# EAGLE design ESP_flagServer (EAGLE 9.6.2)
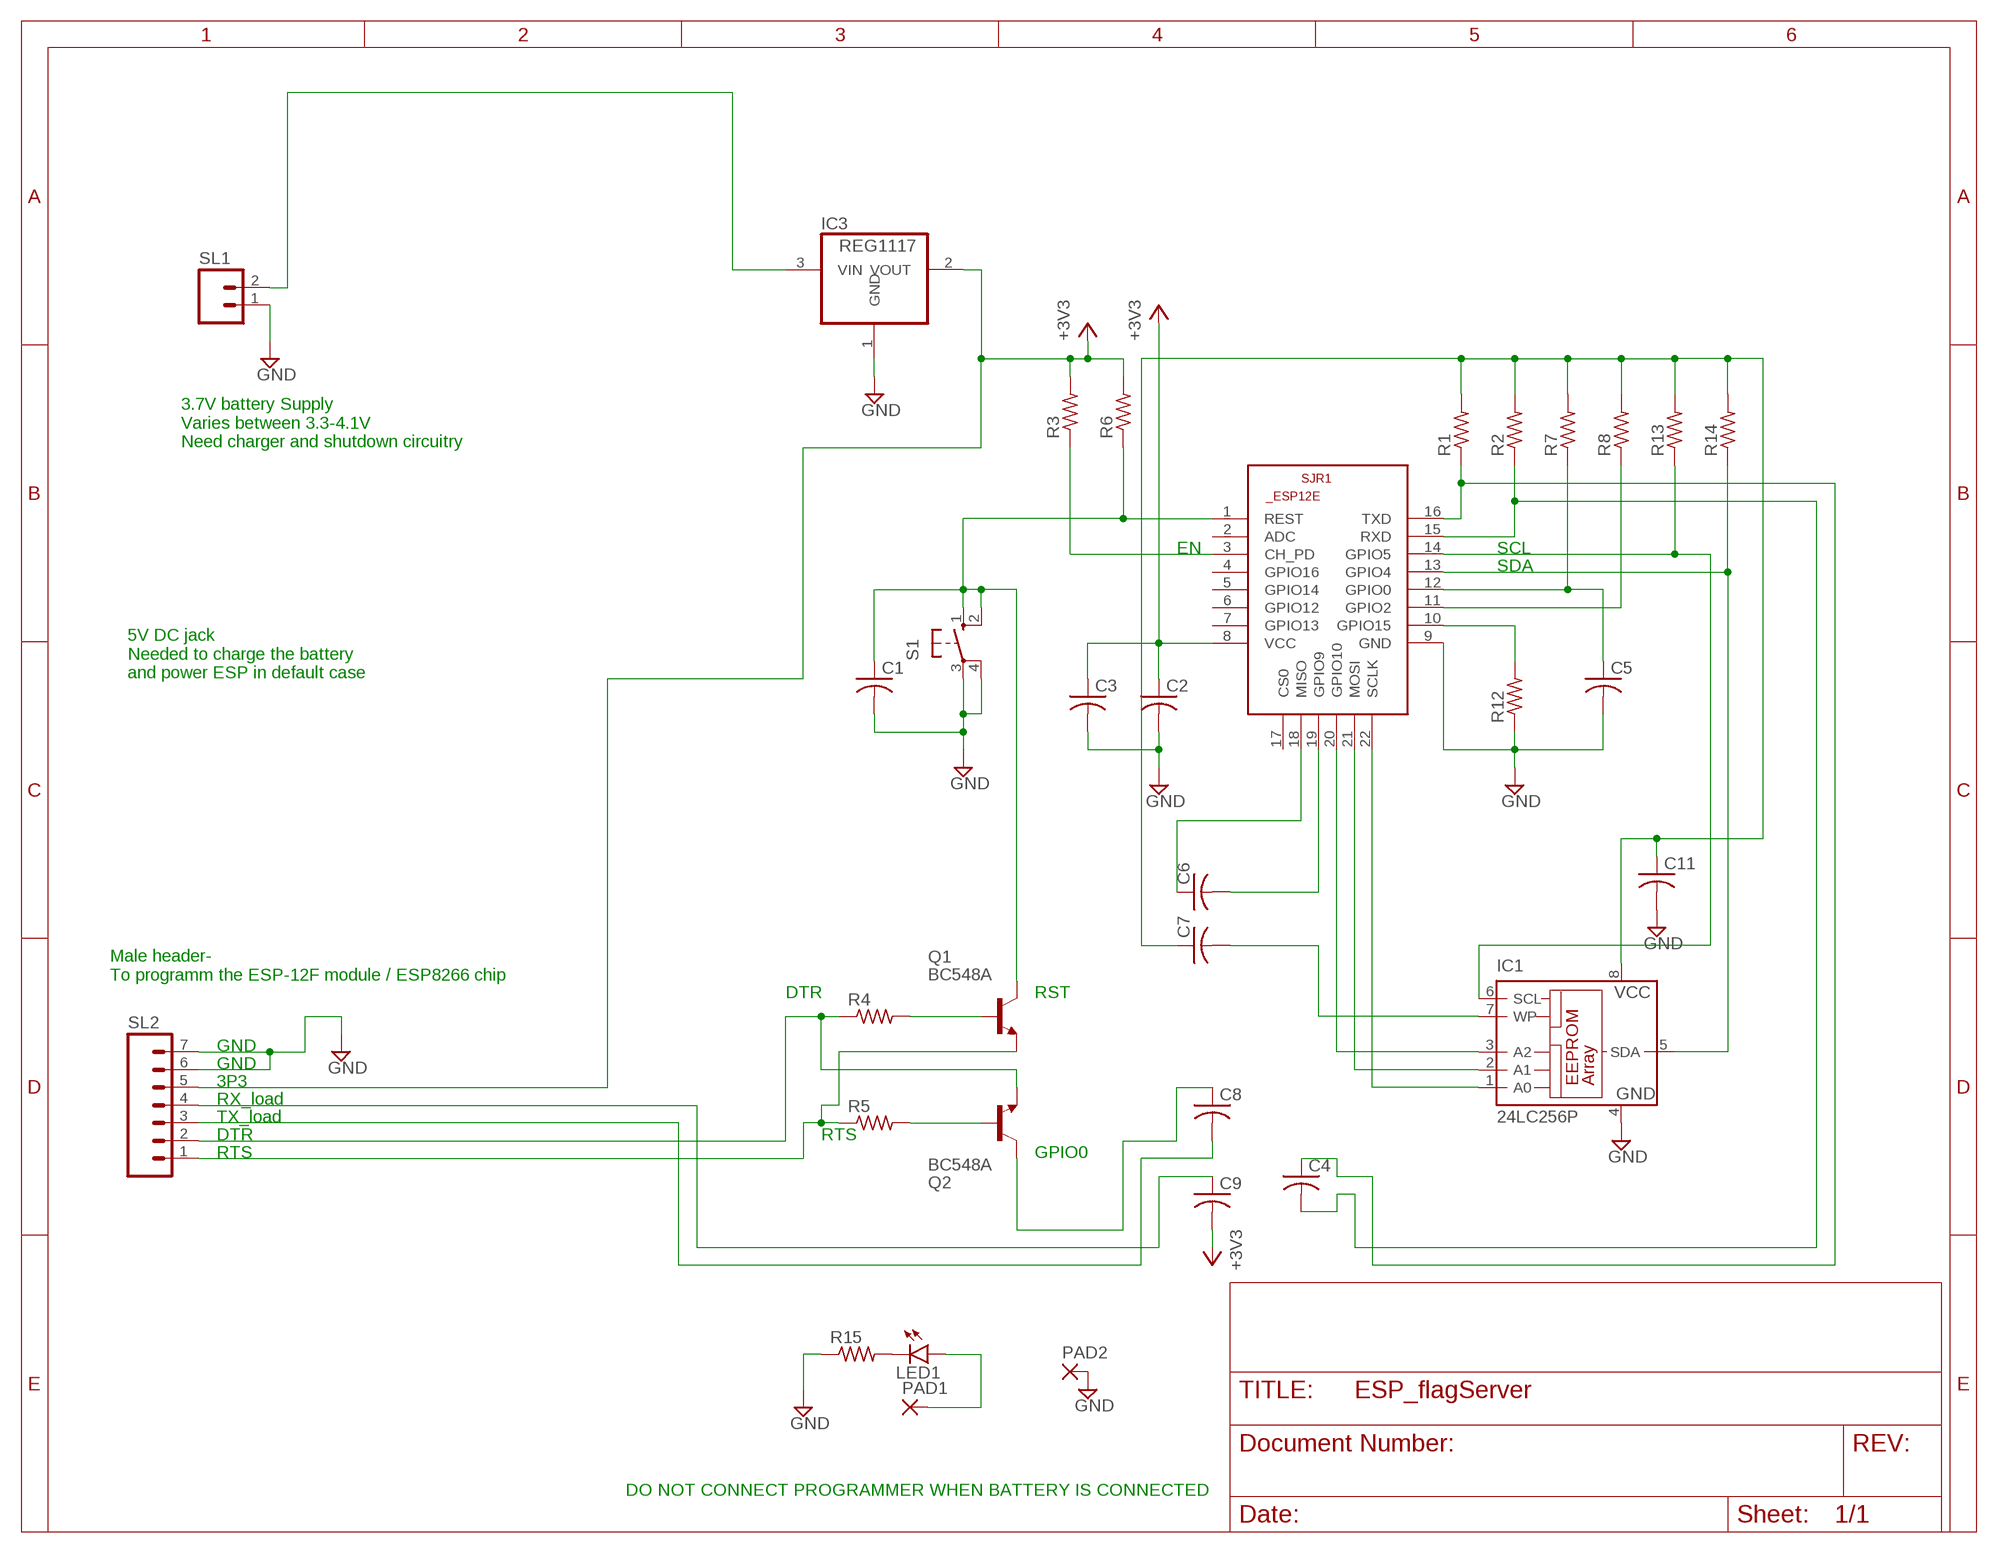
[diagram p0: schematic, sheet 1]

## Parts
C1  C-US050-024X044  [C050-024X044]
C2  C-US050-024X044  [C050-024X044]
C3  C-US050-024X044  [C050-024X044]
C4  C-US025-024X044  [C025-024X044]
C5  C-US025-024X044  [C025-024X044]
C6  C-US025-024X044  [C025-024X044]
C7  C-US025-024X044  [C025-024X044]
C8  C-US025-024X044  [C025-024X044]
C9  C-US025-024X044  [C025-024X044]
C11  C-US025-024X044  [C025-024X044]
IC1  24LC256P  [DIL8]
IC3  REG1117  [SOT223]
LED1  LED3MM  [LED3MM]
PAD1  2,15/1,0  [2,15/1,0]
PAD2  2,15/1,0  [2,15/1,0]
Q1  BC548A  [TO92-EBC]
Q2  BC548A  [TO92-EBC]
R1  R-US_0204/7  [0204/7]
R2  R-US_0204/7  [0204/7]
R3  R-US_0204/7  [0204/7]
R4  R-US_0204/7  [0204/7]
R5  R-US_0204/7  [0204/7]
R6  R-US_0204/7  [0204/7]
R7  R-US_0204/7  [0204/7]
R8  R-US_0204/7  [0204/7]
R12  R-US_0204/7  [0204/7]
R13  R-US_0204/7  [0204/7]
R14  R-US_0204/7  [0204/7]
R15  R-US_0204/7  [0204/7]
S1  10-XX  [B3F-10XX]
SJR1  ESP8266-12EESP12E  [ESP8266-ESP12E]
SL1  M02  [02P]
SL2  M07  [07P]

## Nets
+3V3: C2.1 C3.1 C9.2 IC3.2(VOUT) R3.2 R6.2 SJR1.8(VCC) SL2.5
GND: C1.2 C2.2 C3.2 C5.2 C11.2 IC1.4(GND) IC3.1(GND) PAD2.1(P) R12.1 R15.1 S1.3(P) S1.4(P1) SJR1.9(GND) SL1.1 SL2.6 SL2.7
N$1: C4.1 R1.1 SJR1.16(TXD)
N$2: Q2.B R5.2
N$3: IC1.6(SCL) R13.1 SJR1.14(GPIO5)
N$4: IC1.5(SDA) R14.1 SJR1.13(GPIO4)
N$5: C8.1 Q2.C
N$6: R8.1 SJR1.11(GPIO2)
N$7: R12.2 SJR1.10(GPIO15)
N$8: LED1.A PAD1.1(P)
N$9: R3.1 SJR1.3(CH_PD)
N$10: IC3.3(VIN) SL1.2
N$11: IC1.1(A0) SJR1.22(SCLK)
N$12: C1.1 Q1.C R6.1 S1.1(S) S1.2(S1) SJR1.1(REST)
N$14: C8.2 SL2.3
N$15: Q1.B R4.2
N$16: Q2.E R4.1 SL2.2
N$17: Q1.E R5.1 SL2.1
N$21: IC1.2(A1) SJR1.21(MOSI)
N$22: IC1.3(A2) SJR1.20(GPIO10)
N$23: C7.2 IC1.7(WP)
N$25: LED1.K(C) R15.2
N$27: C4.2 R2.1 SJR1.15(RXD)
N$28: C6.1 SJR1.18(MISO)
N$29: C9.1 SL2.4
N$30: C5.1 R7.1 SJR1.12(GPIO0)
N$32: C6.2 SJR1.19(GPIO9)
N$34: C7.1 C11.1 IC1.8(VCC) R1.2 R2.2 R7.2 R8.2 R13.2 R14.2
Unconnected: SJR1.2(ADC) SJR1.4(GPIO16) SJR1.5(GPIO14) SJR1.6(GPIO12) SJR1.7(GPIO13) SJR1.17(CS0)

## Notes on the sheet
- 3.7V battery Supply
  Varies between 3.3-4.1V
  Need charger and shutdown circuitry
- EN | SCL
- SDA
- 5V DC jack
  Needed to charge the battery 
  and power ESP in default case
- Male header-
  To programm the ESP-12F module / ESP8266 chip
- DTR | RST
- GND
- GND
- 3P3
- RX_load
- TX_load
- DTR | RTS
- RTS | GPIO0
- DO NOT CONNECT PROGRAMMER WHEN BATTERY IS CONNECTED

## Library data of the parts
C1-C9 C11 = rcl:C-US: CAPACITOR, American symbol; SPICEPREFIX: C
IC1 = microchip:24*: Serial EEPROM I2C; MF: MICROCHIP; MPN: 24LC256-E/P; OC_FARNELL: 9757970; OC_NEWARK: 92C7169
IC3 = burr-brown:REG1117: 800mA and 1A Low Dropout (LDO) Positive Regulator 1.8V, 2.5V, 2.85V, 3.3V, 5V, and Adj; MPN: REG1117; OC_FARNELL: 1097566; OC_NEWARK: 14P6981
LED1 = led:LED: LED OSRAM: - CHIPLED LG R971, LG N971, LY N971, LG Q971, LY Q971, LO R971, LY R971 LH N974, LH R974 LS Q976, LO Q976, LY Q976 LO Q996 - Hyper CHIPLED LW Q18S LB Q993, LB Q99A, LB R99A - SideLED LS A670, LO A670, LY A670, LG A670, LP A670 LB A673, LV A673, LT A673, LW A673 LH A674 LY A675 LS A676, LA A676, LO A676, LY A676, LW A676 LS A679, LY A679, LG A679 - Hyper Micro SIDELED® LS Y876, LA Y876, LO Y876, LY Y876 LT Y87S - SmartLED LW L88C, LW L88S LB L89C, LB L89S, LG L890 LS L89K, LO L89K, LY L89K LS L896, LA L896, LO L896, LY L896 - TOPLED LS T670, LO T670, LY T670, LG T670, LP T670 LSG T670, LSP T670, LSY T670, LOP T670, LYG T670 LG T671, LOG T671, LSG T671 LB T673, LV T673, LT T673, LW T673 LH T674 LS T676, LA T676, LO T676, LY T676, LB T676, LH T676, LSB T676, LW T676 LB T67C, LV T67C, LT T67C, LS T67K, LO T67K, LY T67K, LW E67C LS E67B, LA E67B, LO E67B, LY E67B, LB E67C, LV E67C, LT E67C LW T67C LS T679, LY T679, LG T679 LS T770, LO T770, LY T770, LG T770, LP T770 LB T773, LV T773, LT T773, LW T773 LH T774 LS E675, LA E675, LY E675, LS T675 LS T776, LA T776, LO T776, LY T776, LB T776 LHGB T686 LT T68C, LB T68C - Hyper Mini TOPLED® LB M676 - Mini TOPLED Santana® LG M470 LS M47K, LO M47K, LY M47K Source: http://www.osram.convergy.de LUXEON: - LUMILED® LXK2-PW12-R00, LXK2-PW12-S00, LXK2-PW14-U00, LXK2-PW14-V00 LXK2-PM12-R00, LXK2-PM12-S00, LXK2-PM14-U00 LXK2-PE12-Q00, LXK2-PE12-R00, LXK2-PE12-S00, LXK2-PE14-T00, LXK2-PE14-U00 LXK2-PB12-K00, LXK2-PB12-L00, LXK2-PB12-M00, LXK2-PB14-N00, LXK2-PB14-P00, LXK2-PB14-Q00 LXK2-PR12-L00, LXK2-PR12-M00, LXK2-PR14-Q00, LXK2-PR14-R00 LXK2-PD12-Q00, LXK2-PD12-R00, LXK2-PD12-S00 LXK2-PH12-R00, LXK2-PH12-S00 LXK2-PL12-P00, LXK2-PL12-Q00, LXK2-PL12-R00 Source: www.luxeon.com KINGBRIGHT: KA-3528ASYC Source: www.kingbright.com
PAD1 PAD2 = wirepad:2,15/1,0: THROUGH-HOLE PAD
Q1 Q2 = transistor-npn:BC548*: NPN Transistor
R1-R8 R12-R15 = rcl:R-US_: RESISTOR, American symbol; SPICEPREFIX: R
S1 = switch-omron:10-XX: OMRON SWITCH; MPN: B3F-1000; OC_FARNELL: 176432; OC_NEWARK: 36M3542
SJR1 = esp12e:ESP8266-12E: ESP8266-12E Library for Eagle CAD The author not responsible for any damages or errors!. Created by Suhail jr.lt;/author>
SL1 = con-amp-quick:M02: AMP QUICK CONNECTOR; OC_FARNELL: unknown; OC_NEWARK: unknown
SL2 = con-amp-quick:M07: AMP QUICK CONNECTOR; OC_FARNELL: unknown; OC_NEWARK: unknown

## Board
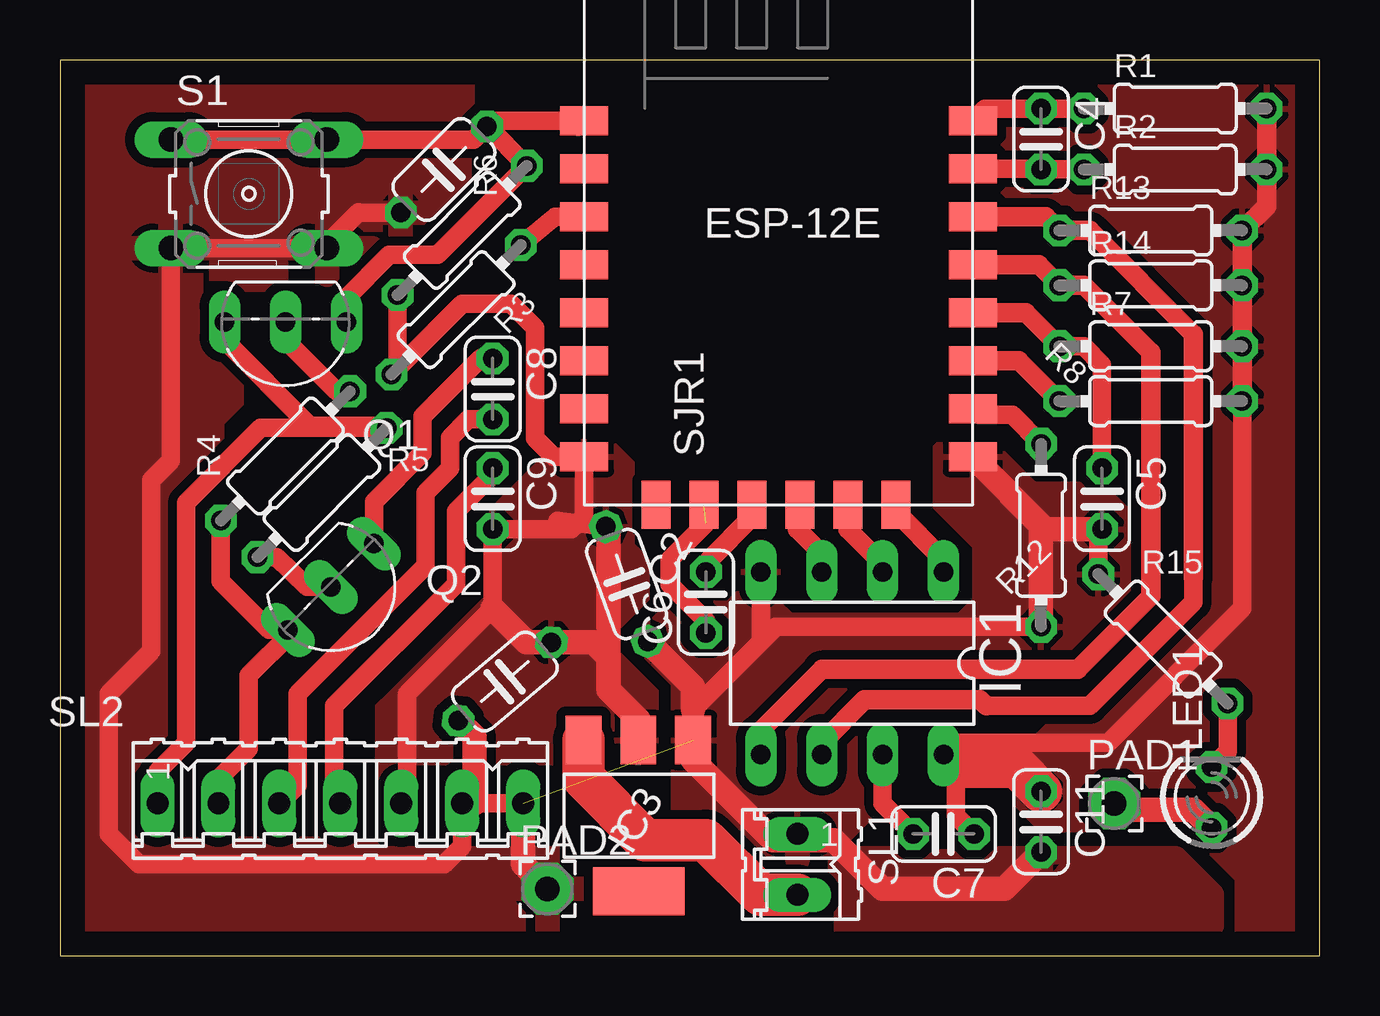
[diagram p1: board, top side]

Size 52.5 x 37.33 mm. Coordinates in mm from the lower left corner, seen from the top.
Outline: 0,0 52.5,0 52.5,37.33 0,37.33 0,0
Copper layers (1*16): Top 0.035mm / dielectric 1.5mm / Bottom 0.035mm
Design rules "default *": minimum track width 6mil, minimum drill 0.35mm, track to track 15mil, track to pad 15mil, pad to pad 15mil, via to via 15mil, smd to smd 6mil, copper to edge 40mil, drill to drill 6mil, minimum pad ring 10mil, minimum via ring 8mil, stop-mask expansion 4mil, vias tented up to drill 0mil, thermal gap 10mil

### Footprints (pad centres in the part's own frame; a part is rotated, then mirrored left to right if it is on the bottom)
C050-024X044 = drill 0.813 octagon: 1 -2.54,0; 2 2.54,0
C025-024X044 = drill 0.813 octagon: 1 -1.27,0; 2 1.27,0
DIL8 = drill 0.813 long: 1 -3.81,-3.81; 2 -1.27,-3.81; 3 1.27,-3.81; 4 3.81,-3.81; 5 3.81,3.81; 6 1.27,3.81; 7 -1.27,3.81; 8 -3.81,3.81
SOT223 = smd 1.499 x 2.007: 1 -2.261,-3.15; 2 0.025,-3.15; 3 2.311,-3.15 | smd 3.81 x 2.007: 4 0,3.15
LED3MM = drill 0.813 octagon: A -1.27,0; K 1.27,0
2,15/1,0 = drill 1.016 pad 2.159 octagon: 1 0,0
TO92-EBC = drill 0.813 long: B 0,-1.27; C -2.54,-1.27; E 2.54,-1.27
0204/7 = drill 0.813 octagon: 1 -3.81,0; 2 3.81,0
B3F-10XX = drill 1.016 long: 1 -3.251,2.261; 2 3.251,2.261; 3 -3.251,-2.261; 4 3.251,-2.261
ESP8266-ESP12E = smd 2 x 1.2: 1 -7.62,5.84; 2 -7.62,3.84; 3 -7.62,1.84; 4 -7.62,-0.16; 5 -7.62,-2.16; 6 -7.62,-4.16; 7 -7.62,-6.16; 8 -7.62,-8.16; 9 8.58,-8.16; 10 8.58,-6.16; 11 8.58,-4.16; 12 8.58,-2.16; 13 8.58,-0.16; 14 8.58,1.84; 15 8.58,3.84; 16 8.58,5.84 | smd 1.2 x 2: 17 -4.62,-10.16; 18 -2.62,-10.16; 19 -0.62,-10.16; 20 1.38,-10.16; 21 3.38,-10.16; 22 5.38,-10.16
02P = drill 0.914 long: 1 -1.27,0; 2 1.27,0
07P = drill 0.914 long: 1 -7.62,0; 2 -5.08,0; 3 -2.54,0; 4 0,0; 5 2.54,0; 6 5.08,0; 7 7.62,0

### Placement (x,y rotation side)
C1  16,32.77 225 top
C2  23.62,15.49 290 top
C3  18.54,11.43 220 top
C4  40.89,34.04 270 top
C5  43.43,19.05 270 top
C6  26.92,14.73 90 top
C7  36.83,5.08 180 top
C8  18.03,23.62 270 top
C9  18.03,19.05 270 top
C11  40.89,5.59 270 top
IC1  33.02,12.19 180 top
IC3  24.13,5.84 180 top
LED1  48.01,6.6 90 top
PAD1  43.94,6.35 0 top
PAD2  20.32,2.79 0 top
Q1  9.4,25.15 180 top
Q2  12.19,14.48 225 top
R1  46.48,35.31 0 top
R2  46.48,32.77 0 top
R3  16.51,26.92 225 top
R4  9.4,20.83 45 top
R5  10.92,19.3 225 top
R6  16.76,30.23 225 top
R7  45.47,25.4 0 top
R8  45.47,23.11 0 top
R12  40.89,17.53 90 top
R13  45.47,30.23 0 top
R14  45.47,27.94 0 top
R15  45.97,13.21 315 top
S1  7.87,31.75 0 top
SJR1  29.46,28.96 0 top
SL1  30.73,3.81 270 top
SL2  11.68,6.35 0 top

### Tracks (layer width: path | path; a pad name or v marks a point on that pad's centre or on a via)
+3V3
  Top 0.762: C9.2 21.32,17.78 21.84,18.31 SJR1.8 20.57,20.8 19.81,21.56 19.81,26.16 18.8,27.18 16.76,27.18 14.07,24.48 | R6.2 14.07,24.48 | 14.07,24.48 R3.2 | SL2.5 14.48,6.6 14.48,10.92 18.03,14.48 C9.2 | 20.75,18.13 C2.1 | C9.2 18.53,17.78
  Top 1.016: IC3.2 24.11,9.85 22.86,11.09 22.86,12.45 | C2.1 22.86,17.77 22.86,12.45 | 22.86,12.45 22.24,13.06 C3.1 19.45,13.06 18.03,14.48
  pour Top: 13.21,6.99 13.21,10.41 13.72,10.92 17.91,15.11 17.91,18.54 18.03,18.67 20.83,21.46 21.21,21.46 22.99,21.46 23.88,20.57 23.88,17.14 24.51,16.51 24.51,14.86 24.38,14.73 23.11,13.46 23.11,12.83 24.89,11.05 24.89,8 14.48,8 13.46,6.99
GND  (1 unrouted)
  Top 0.762: C1.2 12.46,30.97 12.45,30.99 11.12,29.67 S1.4 S1.3 4.62,20.62 3.81,19.81 3.81,12.7 2.03,10.92 2.03,5.08 3.3,3.81 16,3.81 16.76,4.57 SL2.6 17.27,6.35 SL2.7 19.3,5.84 | IC1.4 29.21,13.08 | 29.21,13.08 29.84,13.72 R12.1 | 29.21,13.08 26.39,10.26 IC3.1 | R15.1 43.28,17.63 C5.2
  Top 1.016: SJR1.9 41.06,17.78 | C5.2 40.89,17.78 R12.1 | C11.2 39.37,2.79 34.29,2.79 32.26,4.83 30.99,4.83 | 30.99,4.83 SL1.1 | IC3.1 26.39,8.15 29.72,4.83 30.99,4.83 | C2.2 26.39,11.21 26.39,10.26 | C3.2 17.27,9.12 17.27,6.35 | SL2.7 19.3,3.81 PAD2.1
  pour Top: 20.57,36.83 20.57,36.58 19.3,35.31 6.35,22.35 6.35,10.92 13.21,4.06 17.78,4.06 46.48,4.06 48.01,2.54 48.01,1.27 46.99,0.25 1.02,0.25 0.76,0.51 0.76,36.83
  pour Top: 36.58,21.34 36.45,21.21 36.45,18.67 38.1,17.02 38.1,16.76 38.1,14.86 37.85,14.61 37.47,14.22 30.48,14.22 29.97,14.73 29.97,17.27 29.08,17.27 28.45,16.64 28.45,15.37 27.81,14.73 25.4,14.73 24.13,13.46 24.13,12.7 25.53,11.3 25.53,11.05 25.53,6.1 25.78,5.84 27.56,4.06 32.13,4.06 40.64,12.57 40.64,19.43 40.64,19.68 39.12,21.21 38.99,21.34
  pour Top: 40.64,19.68 43.43,19.68 44.58,18.54 44.58,13.59 43.56,12.57 40.39,12.57 40.26,12.7 40.26,19.3
N$1
  Top 0.762: SJR1.16 38.55,35.31 C4.1 R1.1
N$2
  Top 0.762: Q2.B 10.31,15.38 9.03,16.61 R5.2
N$3
  Top 0.762: 47.24,15.75 47.24,14.73 42.93,10.41 38.61,10.41
  Top 0.813: SJR1.14 41.09,30.8 R13.1 42.93,30.23 47.24,25.91 47.24,15.75 | 38.61,10.41 38.35,10.67 33.53,10.67 31.75,8.89 IC1.6
N$4
  Top 0.762: 45.47,14.99 42.42,11.94 | 31.75,11.94 29.21,9.4 IC1.5
  Top 0.813: SJR1.13 40.8,28.8 R14.1 42.67,27.94 45.47,25.15 45.47,14.99 | 42.42,11.94 31.75,11.94
N$5
  Top 0.762: C8.1 17.53,24.89 15.11,22.48 15.11,20.95 13.09,18.93 Q2.C
N$6
  Top 0.813: SJR1.11 39.97,24.8 R8.1
N$7
  Top 0.762: R12.2 39.69,22.54 38.3,22.54 SJR1.10
N$8
  Top 1.016: LED1.A 47.24,6.1 44.2,6.1 PAD1.1
N$9
  Top 0.762: R3.1 20.64,30.8 SJR1.3
N$10
  Top 1.778: IC3.3 21.82,7.39 24.38,4.83 26.92,4.83 29.21,2.54 SL1.2
N$11
  Top 0.813: IC1.1 36.83,16.51 34.84,18.5 SJR1.22
N$12
  Top 0.762: 21.59,34.54 SJR1.1 18.05,34.8 17.82,34.56 | Q1.C 11.94,27.43 13.72,29.21 15.75,29.21 R6.1 17.82,34.56 | 17.82,34.56 C1.1 17.25,34.01 S1.2 S1.1
  Top 0.813: Q1.C 11.93,26.4
N$14
  Top 0.762: C8.2 17.02,22.35 16.26,21.59 16.26,20.32 15.24,19.3 15.24,16.26 9.91,10.92 9.91,7.11 SL2.3
N$15
  Top 0.762: Q1.B 9.4,25.65 11.53,23.52 R4.2
N$16
  Top 0.762: 9.62,13.2 Q2.E | R4.1 6.7,15.6 8.73,13.58 Q2.E | SL2.2 6.6,7.37 7.87,8.64 7.87,11.68 9.63,13.44 Q2.E
N$17
  Top 0.762: Q1.E 6.86,25.65 10.41,22.1 13.52,22.1 R5.1 8.37,22 5.26,18.88 5.26,8.89 4.06,7.7 SL2.1
N$21
  Top 0.813: SJR1.21 32.84,17.78 34.29,16.33 IC1.2
N$22
  Top 0.813: IC1.3 31.75,16.76 30.73,17.78 30.73,18.69 SJR1.20
N$23
  Top 0.762: IC1.7 34.29,6.35 C7.2
N$25
  Top 0.762: R15.2 48.67,8.54 LED1.K
N$27
  Top 0.762: R2.1 C4.2 40.86,32.8 SJR1.15
N$28  (1 unrouted)
  Top 0.762: C6.1 26.92,13.97 25.4,15.49 25.4,16.51 26.92,18.03
N$29
  Top 0.762: C9.1 18.03,20.04 16.51,18.52 16.51,15.49 11.43,10.41 11.43,6.6 SL2.4
N$30
  Top 0.762: R7.1 42.67,25.4 43.43,24.64 C5.1
  Top 0.813: SJR1.12 40.26,26.8 R7.1
N$32
  Top 0.813: SJR1.19 28.84,18.29 27.07,16.51 27.07,16.04 C6.2
N$34
  Top 0.762: R8.2 49.28,14.48 43.69,8.89 37.34,8.89 IC1.8 37.34,7.87 37.34,5.84 C7.1
  Top 0.813: R1.2 R2.2 50.29,31.24 R13.2 R14.2 R7.2 R8.2
  Top 1.778: C11.1 39.88,7.87 37.34,7.87
  pour Top: 38.23,37.08 38.23,23.62 38.48,23.37 40.01,23.37 46.48,16.89 46.48,14.99 39.75,8.26 39.75,6.35 40.89,5.21 46.99,5.21 49.02,3.17 49.02,0.64 49.28,0.38 52.32,0.38 52.32,36.96 52.2,37.08